# Altium schematic sheet [05] - POWER SUPPLY.SchDoc
size A3; DocumentNumber: 4; SheetNumber: 4; SheetTotal: 6
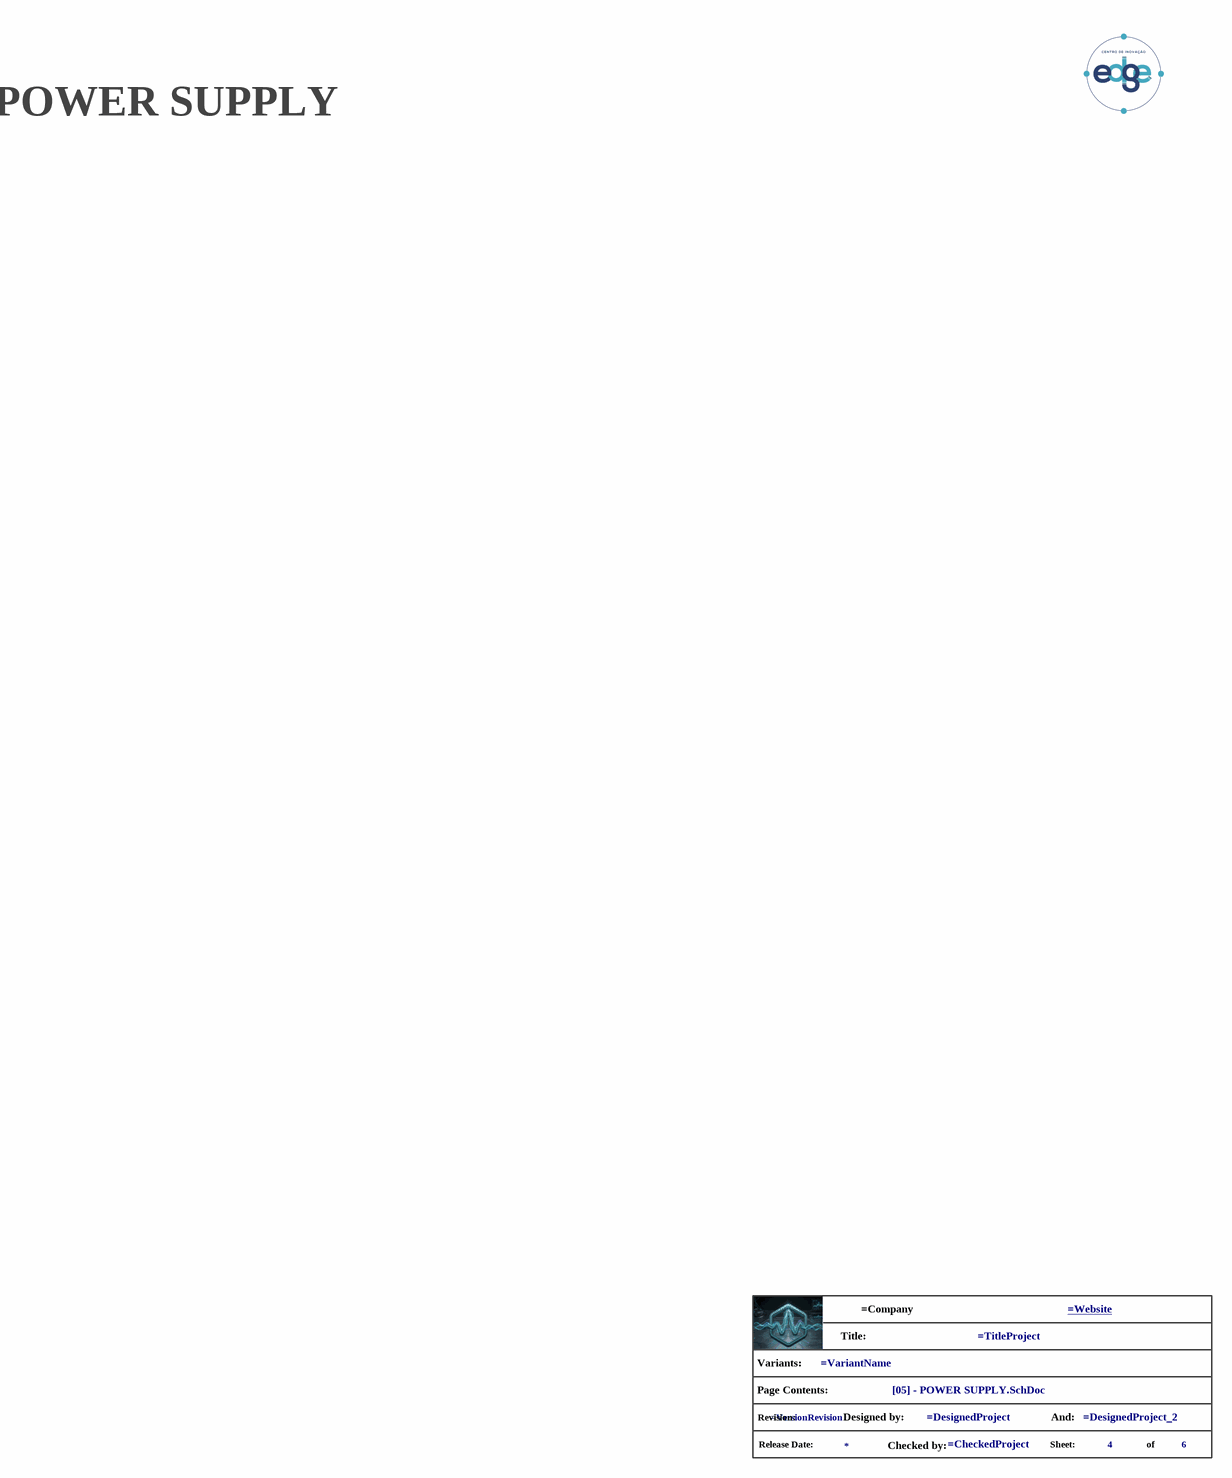
[diagram p0: [05] - POWER SUPPLY.SchDoc]

## Parts
*?  info_project  (value not drawn)  (graphical)

## Notes on the sheet
- POWER SUPPLY
- (in symbol info_project) Title:; Variants:; Page Contents:; Revision:; Designed by:; And:; Release Date:; Checked by:; Sheet:; of

## Library data of the parts
*? = info_project: GRAPHICAL - Info Project